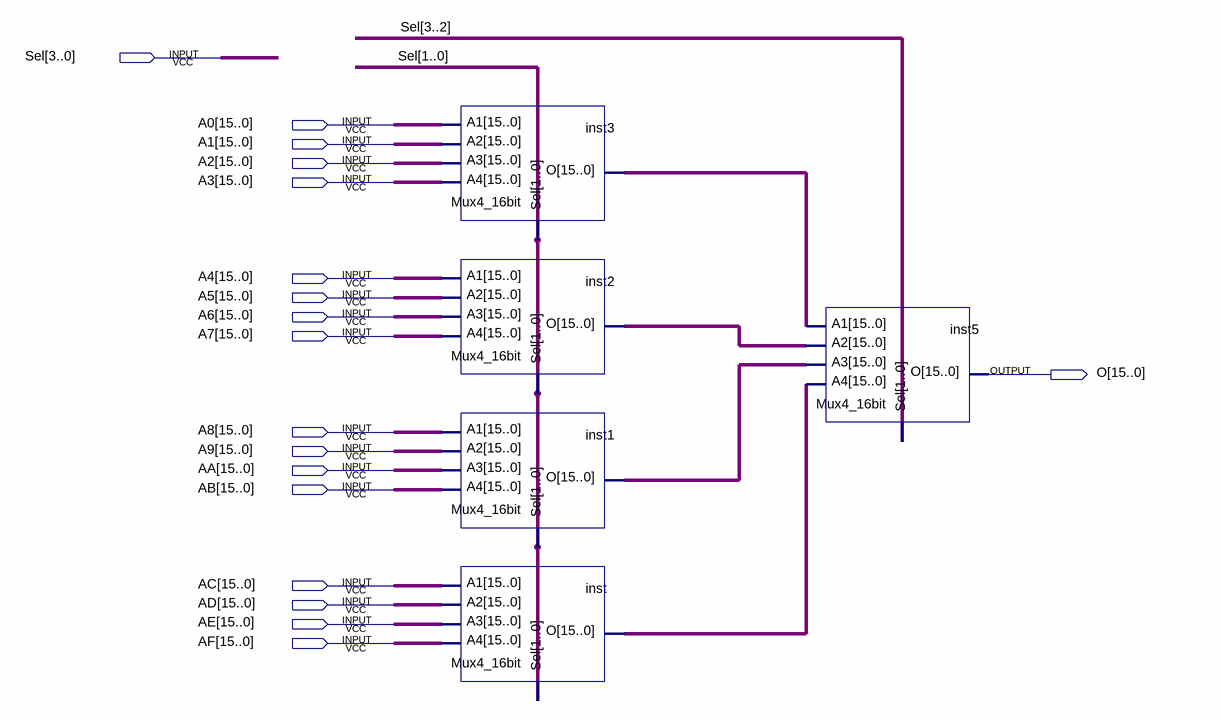
[diagram p0: schematic sheet]
// Quartus schematic Mux16_16bit.bdf as structural Verilog: 5 symbols, 18 pins
module Mux16_16bit (
  input  [3:0] Sel,
  input  [15:0] A0,
  input  [15:0] A1,
  input  [15:0] A2,
  input  [15:0] A3,
  input  [15:0] A4,
  input  [15:0] A5,
  input  [15:0] A6,
  input  [15:0] A7,
  input  [15:0] A8,
  input  [15:0] A9,
  input  [15:0] AA,
  input  [15:0] AB,
  input  [15:0] AC,
  input  [15:0] AD,
  input  [15:0] AE,
  input  [15:0] AF,
  output [15:0] O
);

  wire [15:0] inst1_o, inst2_o, inst3_o, inst_o;

  Mux4_16bit inst3 (.Sel(Sel[1:0]), .A4(A3), .A3(A2), .A2(A1), .A1(A0), .O(inst3_o));
  Mux4_16bit inst2 (.Sel(Sel[1:0]), .A4(A7), .A3(A6), .A2(A5), .A1(A4), .O(inst2_o));
  Mux4_16bit inst1 (.Sel(Sel[1:0]), .A4(AB), .A3(AA), .A2(A9), .A1(A8), .O(inst1_o));
  Mux4_16bit inst (.Sel(Sel[1:0]), .A4(AF), .A3(AE), .A2(AD), .A1(AC), .O(inst_o));
  Mux4_16bit inst5 (.Sel(Sel[3:2]), .A4(inst_o), .A3(inst1_o), .A2(inst2_o), .A1(inst3_o), .O(O));
endmodule
